# Altium schematic sheet LOGICA.SchDoc (part 2 of 2)
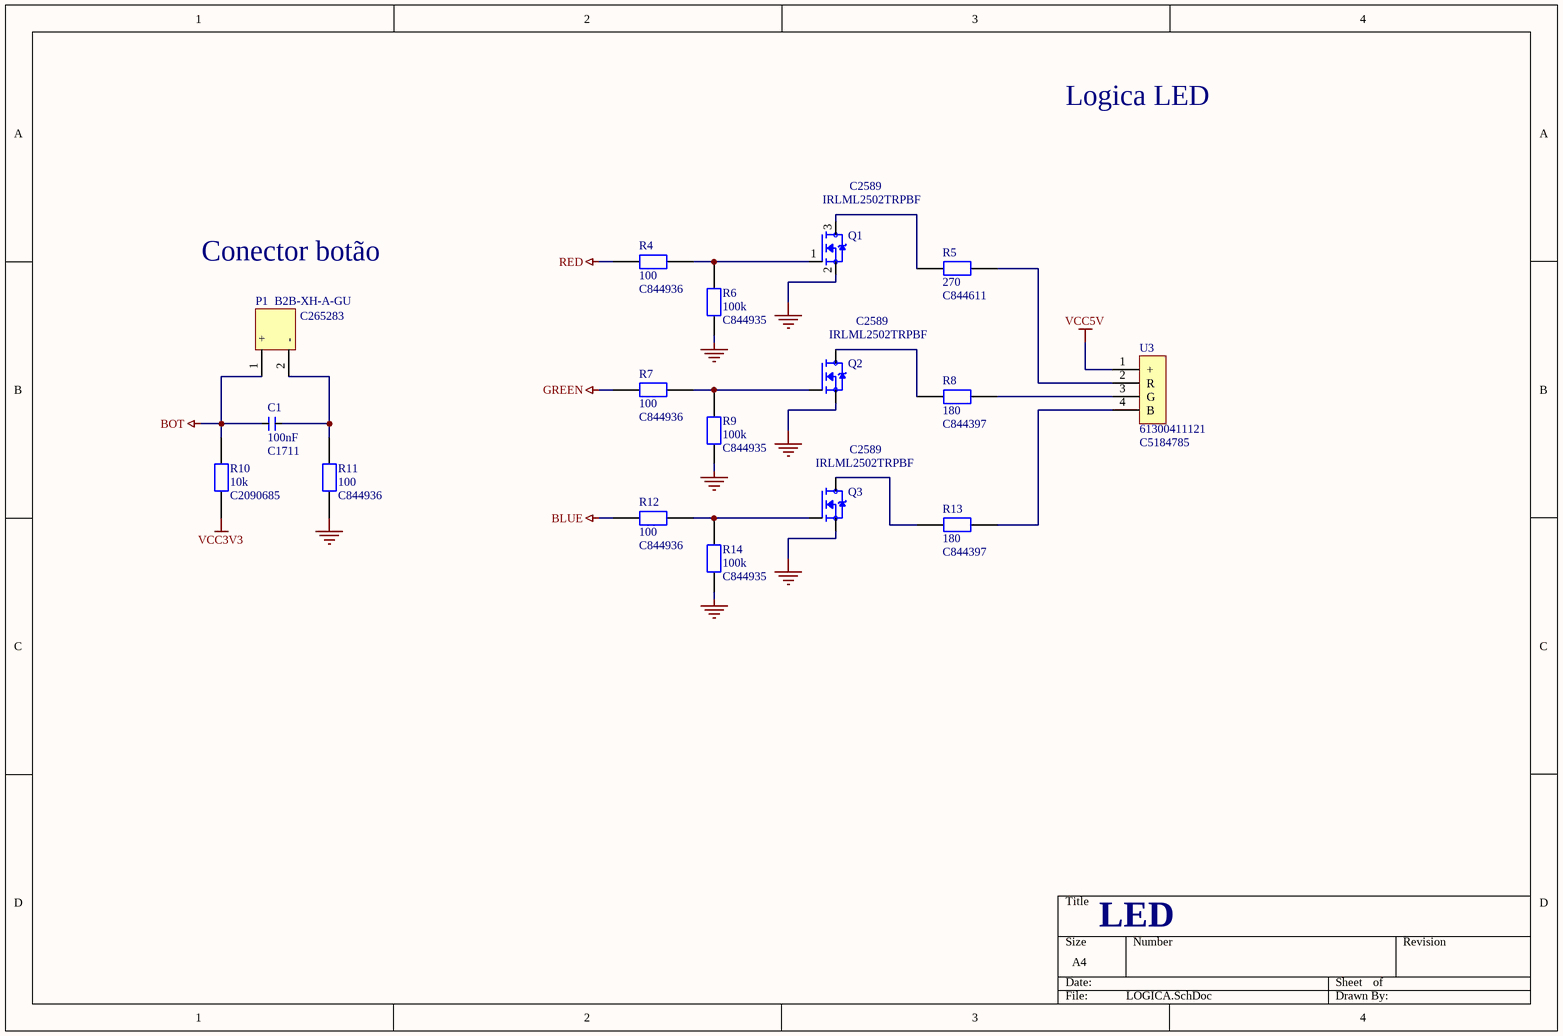
[diagram p1: LOGICA.SchDoc]

## Library data of the parts
C1 = CL21B104KBCNNNC: Ceramic Capacitor, Multilayer, Ceramic, 50V, 10% +Tol, 10% -Tol, X7R, +-15% TC, 100nF, Surface Mount, 0805 inch; Manufacturer: Samsung Electro-Mechanics; Supplier 1: Avnet; Supplier Part Number 1: CL21B104KBCNNNC; Manufacturer Part Number: CL21B104KBCNNNC; RoHS: Compliant; Category: Ceramic Capacitors; Stock 1: 2653700; Pricing 1: 4000=0,0047, 8000=0,00468, 16000=0,00466, 32000=0,00463, 64000=0,00461 (USD); Capacitance: 100nF; Case/Package: 0805; Case Code (Imperial): 0805; Case Code (Metric): 2012; China RoHS: Compliant; Contact Plating: Tin; Depth: 1.25mm; Dielectric: X7R; Dielectric Material: Ceramic; Height: 950µm; Lead Free: Lead Free; Length: 2mm; Lifecycle Status: Production; Material: Ceramic; Max Operating Temperature: 125°C; Min Operating Temperature: -55°C; Mount: Surface Mount; Number of Terminals: 2; Radiation Hardening: No; REACH SVHC: Yes; Schedule B: 8532240020, 8532240020|8532240020, 8532240020|8532240020|8532240020, 8532240020|8532240020|8532240020|8532240020; Thickness: 939.8µm; Tolerance: 10%; Voltage: 50V; Voltage Rating: 50V; Voltage Rating (DC): 50V; Width: 1.25mm; ComponentLink1URL: https://datasheet.octopart.com:443/CL21B104KBCNNNC-Samsung-Electro-Mechanics-datasheet-137745078.pdf?src-supplier=IHS; ComponentLink1Description: https://datasheet.octopart.com:443/CL21B104KBCNNNC-Samsung-Electro-Mechanics-datasheet-137745078.pdf?src-supplier=IHS; ComponentLink2URL: https://datasheet.octopart.com/CL21B104KBCNNNC-Samsung-Electro-Mechanics-datasheet-8324245.pdf; ComponentLink2Description: https://datasheet.octopart.com/CL21B104KBCNNNC-Samsung-Electro-Mechanics-datasheet-8324245.pdf; ComponentLink3URL: https://datasheet.octopart.com/CL21B104KBCNNNC-Samsung-Electro-Mechanics-datasheet-97040617.pdf; ComponentLink3Description: https://datasheet.octopart.com/CL21B104KBCNNNC-Samsung-Electro-Mechanics-datasheet-97040617.pdf; ComponentLink4URL: https://datasheet.octopart.com:443/CL21B104KBCNNNC-Samsung-Electro-Mechanics-datasheet-11548950.pdf?src-supplier=Future+Electronics; ComponentLink4Description: https://datasheet.octopart.com:443/CL21B104KBCNNNC-Samsung-Electro-Mechanics-datasheet-11548950.pdf?src-supplier=Future+Electronics; ComponentLink5URL: https://datasheet.octopart.com:443/CL21B104KBCNNNC-Samsung-Electro-Mechanics-datasheet-116891032.pdf?src-supplier=Future+Electronics; ComponentLink5Description: https://datasheet.octopart.com:443/CL21B104KBCNNNC-Samsung-Electro-Mechanics-datasheet-116891032.pdf?src-supplier=Future+Electronics; ComponentLink6URL: https://datasheet.octopart.com:443/CL21B104KBCNNNC-Samsung-Electro-Mechanics-datasheet-81462175.pdf?src-supplier=Future+Electronics; ComponentLink6Description: https://datasheet.octopart.com:443/CL21B104KBCNNNC-Samsung-Electro-Mechanics-datasheet-81462175.pdf?src-supplier=Future+Electronics; ComponentLink7URL: https://datasheet.octopart.com:443/CL21B104KBCNNNC-Samsung-datasheet-42485244.pdf?src-supplier=Future+Electronics; ComponentLink7Description: https://datasheet.octopart.com:443/CL21B104KBCNNNC-Samsung-datasheet-42485244.pdf?src-supplier=Future+Electronics; ComponentLink8URL: https://datasheet.octopart.com:443/CL21B104KBCNNNC-Samsung-Electro-Mechanics-datasheet-149045937.pdf?src-supplier=Future+Electronics; ComponentLink8Description: https://datasheet.octopart.com:443/CL21B104KBCNNNC-Samsung-Electro-Mechanics-datasheet-149045937.pdf?src-supplier=Future+Electronics; ComponentLink9URL: https://datasheet.octopart.com:443/CL21B104KBCNNNC-Samsung-datasheet-8326407.pdf?src-supplier=TME; ComponentLink9Description: https://datasheet.octopart.com:443/CL21B104KBCNNNC-Samsung-datasheet-8326407.pdf?src-supplier=TME
P1 = B2B-XH-A-GU: Conector 2 pinos; Manufacturer: JST; Connector Type: Male Pin; Number of Positions: 2; Pitch: 2.4892mm; Supplier: DigiKey; Supplier Part Number: 455-2946-ND; Manufacturer Part Number: B2B-XH-A-GU; Category: Headers and Wire Housings; Stock: 16934; Pricing: 1=0,25, 10=0,212, 100=0,1804, 500=0,16102, 1000=0,15333, 5000=0,13685, 10000=0,13032 (USD); Color: Natural; Contact Gender: Male; Contact Material: Brass; Contact Plating: Tin; Fastening Type: Detent; Lead Free: Lead Free; Lifecycle Status: Production; Mounting Technology: Through Hole; Pins: 2; Number of Rows: 1; RoHS: Non-Compliant; Terminal Pitch: 2.5mm; Termination: Press-Fit; ComponentLink1URL: https://datasheet.octopart.com:443/B2B-XH-A-GU-JST-datasheet-12510042.pdf?src-supplier=IHS; ComponentLink1Description: https://datasheet.octopart.com:443/B2B-XH-A-GU-JST-datasheet-12510042.pdf?src-supplier=IHS; ComponentLink2URL: https://datasheet.octopart.com:443/B2B-XH-A-GU-JST-datasheet-140264791.pdf?src-supplier=LKR; ComponentLink2Description: https://datasheet.octopart.com:443/B2B-XH-A-GU-JST-datasheet-140264791.pdf?src-supplier=LKR; ComponentLink3URL: https://datasheet.octopart.com:443/B2B-XH-A-GU-JST-datasheet-8325564.pdf?src-supplier=Future+Electronics; ComponentLink3Description: https://datasheet.octopart.com:443/B2B-XH-A-GU-JST-datasheet-8325564.pdf?src-supplier=Future+Electronics
Q1-Q3 = IRLML2502TRPBF: Transistor: N-MOSFET; unipolar; 12V; 4.3A; 0.05ohm; 1.3W; -55+150 deg.C; SMD; SOT23; Manufacturer: Infineon; Manufacturer Package Identifier: Micro3™; Continuous Drain Current (ID): 4.2A; Drain to Source Breakdown Voltage: 20V; Drain to Source Resistance: 45mΩ; Element Configuration: Single; Fall Time: 26ns; Input Capacitance: 740pF; Max Junction Temperature (Tj): 150°C; Max Power Dissipation: 1.25W; Nominal Vgs: 1.2V; Number of Elements: 1; Value: 45mΩ; Rise Time: 10ns; Turn-Off Delay Time: 54ns; Turn-On Delay Time: 7.5ns; Supplier: DigiKey; Supplier Part Number: IRLML2502TRPBFCT-ND; Manufacturer Part Number: IRLML2502TRPBF; RoHS: Compliant; Category: MOSFETs; Stock: 39178; Pricing: 1=0,52, 10=0,323, 100=0,2053, 500=0,15428, 1000=0,13782 (USD); Case/Package: SOT-23; Contact Plating: Tin; Current Rating: 4.2A; Drain to Source Voltage (Vdss): 20V; Dual Supply Voltage: 20V; Gate to Source Voltage (Vgs): 12V; Height: 1.016mm; Lead Free: Lead Free; Length: 2.794mm; Lifecycle Status: NRND; Max Operating Temperature: 150°C; Min Breakdown Voltage: 20V; Min Operating Temperature: -55°C; Mounting Technology: Surface Mount; Pins: 3; Number of Terminals: 3; On-State Resistance: 45mΩ; Package Quantity: 3000; Packaging: Tape & Reel; Power Dissipation: 1.25W; Radiation Hardening: No; Rds On Max: 45mΩ; REACH SVHC: Yes; Schedule B: 8541290080, 8541290080|8541290080|8541290080|8541290080|8541290080; Termination: SMD/SMT; Threshold Voltage: 1.2V; Voltage Rating (DC): 20V; ComponentLink1URL: https://datasheet.octopart.com:443/IRLML2502TRPBF-Infineon-datasheet-34171437.pdf?src-supplier=IHS; ComponentLink1Description: https://datasheet.octopart.com:443/IRLML2502TRPBF-Infineon-datasheet-34171437.pdf?src-supplier=IHS; ComponentLink2URL: https://datasheet.octopart.com:443/IRLML2502-International-Rectifier-datasheet-180124963.pdf?src-supplier=IHS; ComponentLink2Description: https://datasheet.octopart.com:443/IRLML2502-International-Rectifier-datasheet-180124963.pdf?src-supplier=IHS; ComponentLink3URL: https://datasheet.octopart.com:443/IRLML2502TRPBF-Infineon-datasheet-180073321.pdf?src-supplier=Newark; ComponentLink3Description: https://datasheet.octopart.com:443/IRLML2502TRPBF-Infineon-datasheet-180073321.pdf?src-supplier=Newark; ComponentLink4URL: https://datasheet.octopart.com:443/IRLML2502TRPBF-International-Rectifier-datasheet-28942.pdf?src-supplier=element14+APAC; ComponentLink4Description: https://datasheet.octopart.com:443/IRLML2502TRPBF-International-Rectifier-datasheet-28942.pdf?src-supplier=element14+APAC; ComponentLink5URL: https://datasheet.octopart.com:443/IRLML2502TRPBF-Infineon-datasheet-10898080.pdf?src-supplier=element14+APAC; ComponentLink5Description: https://datasheet.octopart.com:443/IRLML2502TRPBF-Infineon-datasheet-10898080.pdf?src-supplier=element14+APAC; ComponentLink6URL: https://datasheet.octopart.com:443/IRLML2502TRPBF-Infineon-datasheet-7576328.pdf?src-supplier=element14+APAC; ComponentLink6Description: https://datasheet.octopart.com:443/IRLML2502TRPBF-Infineon-datasheet-7576328.pdf?src-supplier=element14+APAC; ComponentLink7URL: https://datasheet.octopart.com:443/IRLML2502TRPBF-International-Rectifier-datasheet-14058069.pdf?src-supplier=iiiC; ComponentLink7Description: https://datasheet.octopart.com:443/IRLML2502TRPBF-International-Rectifier-datasheet-14058069.pdf?src-supplier=iiiC; ComponentLink8URL: https://datasheet.octopart.com:443/IRLML2502-International-Rectifier-datasheet-10851050.pdf?src-supplier=iiiC; ComponentLink8Description: https://datasheet.octopart.com:443/IRLML2502-International-Rectifier-datasheet-10851050.pdf?src-supplier=iiiC; ComponentLink9URL: https://datasheet.octopart.com:443/IRLML2502TRPBF-Infineon-datasheet-9906866.pdf?src-supplier=RS+(Formerly+Allied+Electronics); ComponentLink9Description: https://datasheet.octopart.com:443/IRLML2502TRPBF-Infineon-datasheet-9906866.pdf?src-supplier=RS+(Formerly+Allied+Electronics); ComponentLink10URL: https://datasheet.octopart.com:443/IRLML2502TRPBF-International-Rectifier-datasheet-10470232.pdf?src-supplier=TME; ComponentLink10Description: https://datasheet.octopart.com:443/IRLML2502TRPBF-International-Rectifier-datasheet-10470232.pdf?src-supplier=TME; ComponentLink11URL: https://datasheet.octopart.com:443/IRLML2502TRPBF-International-Rectifier-datasheet-8360198.pdf?src-supplier=Jameco; ComponentLink11Description: https://datasheet.octopart.com:443/IRLML2502TRPBF-International-Rectifier-datasheet-8360198.pdf?src-supplier=Jameco; ComponentLink12URL: https://datasheet.octopart.com:443/IRLML2502TRPBF-International-Rectifier-datasheet-63679.pdf?src-supplier=Farnell; ComponentLink12Description: https://datasheet.octopart.com:443/IRLML2502TRPBF-International-Rectifier-datasheet-63679.pdf?src-supplier=Farnell; ComponentLink13URL: https://datasheet.octopart.com:443/IRLML2502TRPBF-International-Rectifier-datasheet-89315.pdf?src-supplier=DigiKey; ComponentLink13Description: https://datasheet.octopart.com:443/IRLML2502TRPBF-International-Rectifier-datasheet-89315.pdf?src-supplier=DigiKey; ComponentLink14URL: http://sigma.octopart.com:80/conflict_mineral_statement/Infineon-company-51.pdf?src-supplier=Compliance+Statements; ComponentLink14Description: http://sigma.octopart.com:80/conflict_mineral_statement/Infineon-company-51.pdf?src-supplier=Compliance+Statements; ComponentLink15URL: http://sigma.octopart.com:80/rohs_statement/International-Rectifier-company-54.pdf?src-supplier=Compliance+Statements; ComponentLink15Description: http://sigma.octopart.com:80/rohs_statement/International-Rectifier-company-54.pdf?src-supplier=Compliance+Statements; ComponentLink16URL: http://sigma.octopart.com:80/reach_statement/International-Rectifier-company-55.pdf?src-supplier=Compliance+Statements; ComponentLink16Description: http://sigma.octopart.com:80/reach_statement/International-Rectifier-company-55.pdf?src-supplier=Compliance+Statements
R4 R7 R11 R12 = CRCW0805100RFKEA: Res Thick Film 0805 100 Ohm 1% 0.125W(1/8W) ±100ppm/℃ Pad SMD Automotive T/R; Manufacturer: Vishay; Manufacturer Package Identifier: CRCW0805-e3; Max Power Dissipation: 125mW; Value: 100Ω; Temperature Coefficient: 100ppm/°C; Voltage Rating: 150V; Supplier: DigiKey; Supplier Part Number: 541-100CCT-ND; Manufacturer Part Number: CRCW0805100RFKEA; RoHS: Compliant; Category: Chip SMD Resistors; Stock: 224684; Pricing: 1=0,1, 10=0,041, 25=0,0312, 50=0,0256, 100=0,0212, 250=0,01692, 500=0,01448, 1000=0,01254 (USD); Case/Package: 0805; Case Code (Imperial): 0805; China RoHS: Non-Compliant; Composition: Thick Film; Contact Plating: Tin; Depth: 1.25mm; Features: Automotive AEC-Q200; Height: 450µm; Lead Free: Lead Free; Length: 2mm; Lifecycle Status: Production; Max Operating Temperature: 155°C; Military Standard: Not; Min Operating Temperature: -55°C; Mounting Technology: Surface Mount; Pins: 2; Number of Terminals: 2; Number of Terminations: 2; Power Dissipation: 125mW; Power Rating: 125mW; Radiation Hardening: No; REACH SVHC: Yes; Schedule B: 8533210045, 8533210045|8533210045|8533210045|8533210045|8533210045|8533210045|8533210045|8533210045|8533210045|8533210045|8533210045|8533210045|8533210045|8533210045|8533210045|8533210045|8533210045|8533210045|8533210045|8533210045|8533210045|8533210045|8533210045|85; Termination: SMD/SMT; Tolerance: 1%; Voltage Rating (DC): 150V; Weight: 5.499807mg; Width: 1.25mm; Working Voltage: 150V; ComponentLink1URL: https://datasheet.octopart.com:443/CRCW0805100RFKEA-Vishay-datasheet-175423584.pdf?src-supplier=IHS; ComponentLink1Description: https://datasheet.octopart.com:443/CRCW0805100RFKEA-Vishay-datasheet-175423584.pdf?src-supplier=IHS; ComponentLink2URL: https://datasheet.octopart.com:443/CRCW0805100RFKEA-Vishay-datasheet-83961561.pdf?src-supplier=Newark; ComponentLink2Description: https://datasheet.octopart.com:443/CRCW0805100RFKEA-Vishay-datasheet-83961561.pdf?src-supplier=Newark; ComponentLink3URL: https://datasheet.octopart.com:443/CRCW0805100RFKEA-Vishay-datasheet-11516975.pdf?src-supplier=Newark; ComponentLink3Description: https://datasheet.octopart.com:443/CRCW0805100RFKEA-Vishay-datasheet-11516975.pdf?src-supplier=Newark; ComponentLink4URL: https://datasheet.octopart.com:443/CRCW0805100RFKEA-Vishay-datasheet-41302739.pdf?src-supplier=Newark; ComponentLink4Description: https://datasheet.octopart.com:443/CRCW0805100RFKEA-Vishay-datasheet-41302739.pdf?src-supplier=Newark; ComponentLink5URL: https://datasheet.octopart.com:443/CRCW0805100RFKEA-Vishay-datasheet-33013972.pdf?src-supplier=Newark; ComponentLink5Description: https://datasheet.octopart.com:443/CRCW0805100RFKEA-Vishay-datasheet-33013972.pdf?src-supplier=Newark; ComponentLink6URL: https://datasheet.octopart.com:443/CRCW0805100RFKEA-Vishay-datasheet-62317937.pdf?src-supplier=element14+APAC; ComponentLink6Description: https://datasheet.octopart.com:443/CRCW0805100RFKEA-Vishay-datasheet-62317937.pdf?src-supplier=element14+APAC; ComponentLink7URL: https://datasheet.octopart.com:443/CRCW0805100RFKEA-Vishay-datasheet-14722531.pdf?src-supplier=element14+APAC; ComponentLink7Description: https://datasheet.octopart.com:443/CRCW0805100RFKEA-Vishay-datasheet-14722531.pdf?src-supplier=element14+APAC; ComponentLink8URL: https://datasheet.octopart.com:443/CRCW0805100RFKEA.-Vishay-datasheet-78776209.pdf?src-supplier=element14+APAC; ComponentLink8Description: https://datasheet.octopart.com:443/CRCW0805100RFKEA.-Vishay-datasheet-78776209.pdf?src-supplier=element14+APAC; ComponentLink9URL: https://datasheet.octopart.com:443/CRCW0805100RFKEA-Vishay-datasheet-66077789.pdf?src-supplier=element14+APAC; ComponentLink9Description: https://datasheet.octopart.com:443/CRCW0805100RFKEA-Vishay-datasheet-66077789.pdf?src-supplier=element14+APAC; ComponentLink10URL: https://datasheet.octopart.com:443/CRCW0805100RFKEA-Vishay-datasheet-16179825.pdf?src-supplier=element14+APAC; ComponentLink10Description: https://datasheet.octopart.com:443/CRCW0805100RFKEA-Vishay-datasheet-16179825.pdf?src-supplier=element14+APAC; ComponentLink11URL: https://datasheet.octopart.com:443/CRCW0805100RFKEA-Vishay-datasheet-5300368.pdf?src-supplier=Future+Electronics; ComponentLink11Description: https://datasheet.octopart.com:443/CRCW0805100RFKEA-Vishay-datasheet-5300368.pdf?src-supplier=Future+Electronics; ComponentLink12URL: https://datasheet.octopart.com:443/CRCW0805100RFKEA-Vishay-datasheet-62316122.pdf?src-supplier=Future+Electronics; ComponentLink12Description: https://datasheet.octopart.com:443/CRCW0805100RFKEA-Vishay-datasheet-62316122.pdf?src-supplier=Future+Electronics; ComponentLink13URL: https://datasheet.octopart.com:443/CRCW0805100RFKEA-Vishay-datasheet-5306405.pdf?src-supplier=RS+(Formerly+Allied+Electronics); ComponentLink13Description: https://datasheet.octopart.com:443/CRCW0805100RFKEA-Vishay-datasheet-5306405.pdf?src-supplier=RS+(Formerly+Allied+Electronics); ComponentLink14URL: https://datasheet.octopart.com:443/CRCW0805100RFKEA-Vishay-Dale-datasheet-47688880.pdf?src-supplier=RS+(Formerly+Allied+Electronics); ComponentLink14Description: https://datasheet.octopart.com:443/CRCW0805100RFKEA-Vishay-Dale-datasheet-47688880.pdf?src-supplier=RS+(Formerly+Allied+Electronics); ComponentLink15URL: https://datasheet.octopart.com:443/CRCW0805100RFKEA-Vishay-datasheet-12001583.pdf?src-supplier=RS+(Formerly+Allied+Electronics); ComponentLink15Description: https://datasheet.octopart.com:443/CRCW0805100RFKEA-Vishay-datasheet-12001583.pdf?src-supplier=RS+(Formerly+Allied+Electronics); ComponentLink16URL: https://datasheet.octopart.com:443/CRCW0805100RFKEA-Vishay-datasheet-17834126.pdf?src-supplier=TME; ComponentLink16Description: https://datasheet.octopart.com:443/CRCW0805100RFKEA-Vishay-datasheet-17834126.pdf?src-supplier=TME; ComponentLink17URL: https://datasheet.octopart.com/D-CRCW-e3-Standard-Thick-Film-Chip-Resistors-Vishay-datasheet-family-64.pdf; ComponentLink17Description: https://datasheet.octopart.com/D-CRCW-e3-Standard-Thick-Film-Chip-Resistors-Vishay-datasheet-family-64.pdf; ComponentLink18URL: https://datasheet.octopart.com:443/CRCW0805100RFKEA-Vishay-datasheet-13242068.pdf?src-supplier=Farnell; ComponentLink18Description: https://datasheet.octopart.com:443/CRCW0805100RFKEA-Vishay-datasheet-13242068.pdf?src-supplier=Farnell; ComponentLink19URL: https://datasheet.octopart.com:443/CRCW0805100RFKEA-Vishay-datasheet-13195083.pdf?src-supplier=Farnell; ComponentLink19Description: https://datasheet.octopart.com:443/CRCW0805100RFKEA-Vishay-datasheet-13195083.pdf?src-supplier=Farnell; ComponentLink20URL: https://datasheet.octopart.com:443/CRCW0805100RFKEA-Vishay-datasheet-13034211.pdf?src-supplier=Farnell; ComponentLink20Description: https://datasheet.octopart.com:443/CRCW0805100RFKEA-Vishay-datasheet-13034211.pdf?src-supplier=Farnell; ComponentLink21URL: https://datasheet.octopart.com:443/CRCW0805100RFKEA-Vishay-datasheet-12600034.pdf?src-supplier=Farnell; ComponentLink21Description: https://datasheet.octopart.com:443/CRCW0805100RFKEA-Vishay-datasheet-12600034.pdf?src-supplier=Farnell; ComponentLink22URL: https://datasheet.octopart.com:443/CRCW0805100RFKEA-Vishay-datasheet-12532161.pdf?src-supplier=Farnell; ComponentLink22Description: https://datasheet.octopart.com:443/CRCW0805100RFKEA-Vishay-datasheet-12532161.pdf?src-supplier=Farnell; ComponentLink23URL: https://datasheet.octopart.com:443/CRCW0805100RFKEA-Vishay-datasheet-12517896.pdf?src-supplier=Farnell; ComponentLink23Description: https://datasheet.octopart.com:443/CRCW0805100RFKEA-Vishay-datasheet-12517896.pdf?src-supplier=Farnell; ComponentLink24URL: https://datasheet.octopart.com:443/CRCW0805100RFKEA-Vishay-datasheet-12509762.pdf?src-supplier=Farnell; ComponentLink24Description: https://datasheet.octopart.com:443/CRCW0805100RFKEA-Vishay-datasheet-12509762.pdf?src-supplier=Farnell; ComponentLink25URL: https://datasheet.octopart.com:443/CRCW0805100RFKEA-Vishay-datasheet-10322335.pdf?src-supplier=Farnell; ComponentLink25Description: https://datasheet.octopart.com:443/CRCW0805100RFKEA-Vishay-datasheet-10322335.pdf?src-supplier=Farnell; ComponentLink26URL: https://datasheet.octopart.com:443/CRCW0805100RFKEA-Vishay-datasheet-8788789.pdf?src-supplier=Farnell; ComponentLink26Description: https://datasheet.octopart.com:443/CRCW0805100RFKEA-Vishay-datasheet-8788789.pdf?src-supplier=Farnell; ComponentLink27URL: https://datasheet.octopart.com:443/CRCW0805100RFKEA-Vishay-datasheet-8361388.pdf?src-supplier=Farnell; ComponentLink27Description: https://datasheet.octopart.com:443/CRCW0805100RFKEA-Vishay-datasheet-8361388.pdf?src-supplier=Farnell; ComponentLink28URL: https://datasheet.octopart.com:443/CRCW0805100RFKEA-Vishay-datasheet-546287.pdf?src-supplier=Farnell; ComponentLink28Description: https://datasheet.octopart.com:443/CRCW0805100RFKEA-Vishay-datasheet-546287.pdf?src-supplier=Farnell; ComponentLink29URL: https://datasheet.octopart.com:443/CRCW0805100RFKEA-Vishay-datasheet-11540273.pdf?src-supplier=Arrow+Electronics; ComponentLink29Description: https://datasheet.octopart.com:443/CRCW0805100RFKEA-Vishay-datasheet-11540273.pdf?src-supplier=Arrow+Electronics; ComponentLink30URL: https://datasheet.octopart.com:443/CRCW0805100RFKEA-Vishay-datasheet-8445837.pdf?src-supplier=element14; ComponentLink30Description: https://datasheet.octopart.com:443/CRCW0805100RFKEA-Vishay-datasheet-8445837.pdf?src-supplier=element14; ComponentLink31URL: https://datasheet.octopart.com:443/CRCW0805100RFKEA-Vishay-datasheet-5377306.pdf?src-supplier=Garrett; ComponentLink31Description: https://datasheet.octopart.com:443/CRCW0805100RFKEA-Vishay-datasheet-5377306.pdf?src-supplier=Garrett; ComponentLink32URL: https://datasheet.octopart.com:443/CRCW0805100RFKEA-Vishay-datasheet-148188.pdf?src-supplier=Garrett; ComponentLink32Description: https://datasheet.octopart.com:443/CRCW0805100RFKEA-Vishay-datasheet-148188.pdf?src-supplier=Garrett; ComponentLink33URL: https://datasheet.octopart.com:443/CRCW0805100RFKEA-Vishay-datasheet-34203.pdf?src-supplier=Garrett; ComponentLink33Description: https://datasheet.octopart.com:443/CRCW0805100RFKEA-Vishay-datasheet-34203.pdf?src-supplier=Garrett; ComponentLink34URL: http://sigma.octopart.com:80/rohs_certificate/D-CRCW-e3-Standard-Thick-Film-Chip-Resistors-Vishay-family-102.pdf?src-supplier=Compliance+Statements; ComponentLink34Description: http://sigma.octopart.com:80/rohs_certificate/D-CRCW-e3-Standard-Thick-Film-Chip-Resistors-Vishay-family-102.pdf?src-supplier=Compliance+Statements
R5 = CRCW0805270RFKEA: Res Thick Film 0805 270 Ohm 1% 1/8W ±100ppm/°C Molded SMD SMD Paper T/R; Manufacturer: Vishay; Manufacturer Package Identifier: CRCW0805-e3; Power Dissipation: 125mW; Value: 270Ω; Voltage Rating: 150V; Supplier: DigiKey; Supplier Part Number: 541-270CCT-ND; Manufacturer Part Number: CRCW0805270RFKEA; RoHS: Compliant; Category: Chip SMD Resistors; Stock: 11086; Pricing: 1=0,1, 10=0,041, 25=0,0312, 50=0,0256, 100=0,0212, 250=0,01692, 500=0,01448, 1000=0,01254 (USD); Case/Package: 0805; Case Code (Imperial): 0805; China RoHS: Non-Compliant; Composition: Thick Film; Contact Plating: Tin; Depth: 1.25mm; Height: 450µm; Lead Free: Lead Free; Length: 2mm; Lifecycle Status: Production; Max Operating Temperature: 155°C; Military Standard: Not; Min Operating Temperature: -55°C; Mounting Technology: Surface Mount; Pins: 2; Number of Terminals: 2; Packaging: Cut Tape; Power Rating: 125mW; Radiation Hardening: No; REACH SVHC: Yes; Schedule B: 8533210045, 8533210045|8533210045, 8533210045|8533210045|8533210045, 8533210045|8533210045|8533210045|8533210045; Temperature Coefficient: 100ppm/°C; Termination: SMD/SMT; Tolerance: 1%; Voltage Rating (DC): 150V; Weight: 5.499807mg; Width: 1.25mm; Working Voltage: 150V; ComponentLink1URL: https://datasheet.octopart.com:443/CRCW0805270RFKEA-Vishay-datasheet-175423584.pdf?src-supplier=IHS; ComponentLink1Description: https://datasheet.octopart.com:443/CRCW0805270RFKEA-Vishay-datasheet-175423584.pdf?src-supplier=IHS; ComponentLink2URL: https://datasheet.octopart.com:443/CRCW0805270RFKEA-Vishay-datasheet-83961561.pdf?src-supplier=Newark; ComponentLink2Description: https://datasheet.octopart.com:443/CRCW0805270RFKEA-Vishay-datasheet-83961561.pdf?src-supplier=Newark; ComponentLink3URL: https://datasheet.octopart.com:443/CRCW0805270RFKEA-Vishay-datasheet-11516975.pdf?src-supplier=Newark; ComponentLink3Description: https://datasheet.octopart.com:443/CRCW0805270RFKEA-Vishay-datasheet-11516975.pdf?src-supplier=Newark; ComponentLink4URL: https://datasheet.octopart.com:443/CRCW0805270RFKEA-Vishay-datasheet-41302739.pdf?src-supplier=Newark; ComponentLink4Description: https://datasheet.octopart.com:443/CRCW0805270RFKEA-Vishay-datasheet-41302739.pdf?src-supplier=Newark; ComponentLink5URL: https://datasheet.octopart.com:443/CRCW0805270RFKEA-Vishay-datasheet-33013972.pdf?src-supplier=Newark; ComponentLink5Description: https://datasheet.octopart.com:443/CRCW0805270RFKEA-Vishay-datasheet-33013972.pdf?src-supplier=Newark; ComponentLink6URL: https://datasheet.octopart.com:443/CRCW0805270RFKEA-Vishay-datasheet-62317937.pdf?src-supplier=element14+APAC; ComponentLink6Description: https://datasheet.octopart.com:443/CRCW0805270RFKEA-Vishay-datasheet-62317937.pdf?src-supplier=element14+APAC; ComponentLink7URL: https://datasheet.octopart.com:443/CRCW0805270RFKEA-Vishay-datasheet-10882403.pdf?src-supplier=element14+APAC; ComponentLink7Description: https://datasheet.octopart.com:443/CRCW0805270RFKEA-Vishay-datasheet-10882403.pdf?src-supplier=element14+APAC; ComponentLink8URL: https://datasheet.octopart.com:443/CRCW0805270RFKEA.-Vishay-datasheet-78776209.pdf?src-supplier=element14+APAC; ComponentLink8Description: https://datasheet.octopart.com:443/CRCW0805270RFKEA.-Vishay-datasheet-78776209.pdf?src-supplier=element14+APAC; ComponentLink9URL: https://datasheet.octopart.com:443/CRCW0805270RFKEA-Vishay-datasheet-66077789.pdf?src-supplier=element14+APAC; ComponentLink9Description: https://datasheet.octopart.com:443/CRCW0805270RFKEA-Vishay-datasheet-66077789.pdf?src-supplier=element14+APAC; ComponentLink10URL: https://datasheet.octopart.com:443/CRCW0805270RFKEA-Vishay-datasheet-14722531.pdf?src-supplier=element14+APAC; ComponentLink10Description: https://datasheet.octopart.com:443/CRCW0805270RFKEA-Vishay-datasheet-14722531.pdf?src-supplier=element14+APAC; ComponentLink11URL: https://datasheet.octopart.com:443/CRCW0805270RFKEA-Vishay-datasheet-62316122.pdf?src-supplier=Future+Electronics; ComponentLink11Description: https://datasheet.octopart.com:443/CRCW0805270RFKEA-Vishay-datasheet-62316122.pdf?src-supplier=Future+Electronics; ComponentLink12URL: https://datasheet.octopart.com:443/CRCW0805270RFKEA-Vishay-datasheet-12519820.pdf?src-supplier=Future+Electronics; ComponentLink12Description: https://datasheet.octopart.com:443/CRCW0805270RFKEA-Vishay-datasheet-12519820.pdf?src-supplier=Future+Electronics; ComponentLink13URL: https://datasheet.octopart.com:443/CRCW0805270RFKEA-Vishay-datasheet-11551479.pdf?src-supplier=Future+Electronics; ComponentLink13Description: https://datasheet.octopart.com:443/CRCW0805270RFKEA-Vishay-datasheet-11551479.pdf?src-supplier=Future+Electronics; ComponentLink14URL: https://datasheet.octopart.com:443/CRCW0805270RFKEA-Vishay-datasheet-8325159.pdf?src-supplier=Future+Electronics; ComponentLink14Description: https://datasheet.octopart.com:443/CRCW0805270RFKEA-Vishay-datasheet-8325159.pdf?src-supplier=Future+Electronics; ComponentLink15URL: https://datasheet.octopart.com:443/CRCW0805270RFKEA-Vishay-datasheet-5390187.pdf?src-supplier=Future+Electronics; ComponentLink15Description: https://datasheet.octopart.com:443/CRCW0805270RFKEA-Vishay-datasheet-5390187.pdf?src-supplier=Future+Electronics; ComponentLink16URL: https://datasheet.octopart.com:443/CRCW0805270RFKEA-Vishay-Dale-datasheet-47688880.pdf?src-supplier=RS+(Formerly+Allied+Electronics); ComponentLink16Description: https://datasheet.octopart.com:443/CRCW0805270RFKEA-Vishay-Dale-datasheet-47688880.pdf?src-supplier=RS+(Formerly+Allied+Electronics); ComponentLink17URL: https://datasheet.octopart.com:443/CRCW0805270RFKEA-Vishay-datasheet-12001583.pdf?src-supplier=RS+(Formerly+Allied+Electronics); ComponentLink17Description: https://datasheet.octopart.com:443/CRCW0805270RFKEA-Vishay-datasheet-12001583.pdf?src-supplier=RS+(Formerly+Allied+Electronics); ComponentLink18URL: https://datasheet.octopart.com:443/CRCW0805270RFKEA-Vishay-datasheet-5306405.pdf?src-supplier=RS+(Formerly+Allied+Electronics); ComponentLink18Description: https://datasheet.octopart.com:443/CRCW0805270RFKEA-Vishay-datasheet-5306405.pdf?src-supplier=RS+(Formerly+Allied+Electronics); ComponentLink19URL: https://datasheet.octopart.com:443/CRCW0805270RFKEA-Vishay-datasheet-8445837.pdf?src-supplier=element14; ComponentLink19Description: https://datasheet.octopart.com:443/CRCW0805270RFKEA-Vishay-datasheet-8445837.pdf?src-supplier=element14; ComponentLink20URL: https://datasheet.octopart.com:443/CRCW0805270RFKEA-Vishay-datasheet-5300368.pdf?src-supplier=Farnell; ComponentLink20Description: https://datasheet.octopart.com:443/CRCW0805270RFKEA-Vishay-datasheet-5300368.pdf?src-supplier=Farnell; ComponentLink21URL: http://sigma.octopart.com:80/rohs_statement/Vishay-company-15.pdf?src-supplier=Compliance+Statements; ComponentLink21Description: http://sigma.octopart.com:80/rohs_statement/Vishay-company-15.pdf?src-supplier=Compliance+Statements
R6 R9 R14 = CRCW0805100KFKEA: Res Thick Film 0805 100K Ohm 1% 0.125W(1/8W) +/-100ppm/ßC Pad SMD Automotive T/R; Manufacturer: Vishay; Manufacturer Package Identifier: CRCW0805-e3; Power Dissipation: 125mW; Value: 100kΩ; Temperature Coefficient: 100ppm/°C; Voltage Rating: 150V; Supplier: DigiKey; Supplier Part Number: 541-100KCCT-ND; Manufacturer Part Number: CRCW0805100KFKEA; RoHS: Compliant; Category: Chip SMD Resistors; Stock: 307439; Pricing: 1=0,1, 10=0,041, 25=0,0312, 50=0,0256, 100=0,0212, 250=0,01692, 500=0,01448, 1000=0,01254 (USD); Case/Package: 0805; Case Code (Imperial): 0805; China RoHS: Non-Compliant; Composition: Thick Film; Contact Plating: Tin; Depth: 1.25mm; Height: 450µm; Lead Free: Lead Free; Length: 2mm; Lifecycle Status: Production; Max Operating Temperature: 155°C; Military Standard: Not; Min Operating Temperature: -55°C; Mounting Technology: Surface Mount; Pins: 2; Number of Terminals: 2; Packaging: Cut Tape; Power Rating: 125mW; Radiation Hardening: No; REACH SVHC: Yes; Schedule B: 8533210045, 8533210045|8533210045|8533210045|8533210045|8533210045|8533210045|8533210045|8533210045|8533210045|8533210045|8533210045|8533210045|8533210045|8533210045|8533210045|8533210045|8533210045|8533210045|8533210045|8533210045|8533210045|8533210045|8533210045|85; Termination: SMD/SMT; Tolerance: 1%; Voltage Rating (DC): 150V; Weight: 5.499807mg; Width: 1.25mm; Working Voltage: 150V; ComponentLink1URL: https://datasheet.octopart.com:443/CRCW0805100KFKEA-Vishay-datasheet-175423584.pdf?src-supplier=IHS; ComponentLink1Description: https://datasheet.octopart.com:443/CRCW0805100KFKEA-Vishay-datasheet-175423584.pdf?src-supplier=IHS; ComponentLink2URL: https://datasheet.octopart.com:443/CRCW0805100KFKEA-Vishay-datasheet-141435152.pdf?src-supplier=Upverter; ComponentLink2Description: https://datasheet.octopart.com:443/CRCW0805100KFKEA-Vishay-datasheet-141435152.pdf?src-supplier=Upverter; ComponentLink3URL: https://datasheet.octopart.com:443/CRCW0805100KFKEA-Vishay-datasheet-83961561.pdf?src-supplier=element14+APAC; ComponentLink3Description: https://datasheet.octopart.com:443/CRCW0805100KFKEA-Vishay-datasheet-83961561.pdf?src-supplier=element14+APAC; ComponentLink4URL: https://datasheet.octopart.com:443/CRCW0805100KFKEA-Vishay-datasheet-62317937.pdf?src-supplier=element14+APAC; ComponentLink4Description: https://datasheet.octopart.com:443/CRCW0805100KFKEA-Vishay-datasheet-62317937.pdf?src-supplier=element14+APAC; ComponentLink5URL: https://datasheet.octopart.com:443/CRCW0805100KFKEA-Vishay-datasheet-14722531.pdf?src-supplier=element14+APAC; ComponentLink5Description: https://datasheet.octopart.com:443/CRCW0805100KFKEA-Vishay-datasheet-14722531.pdf?src-supplier=element14+APAC; ComponentLink6URL: https://datasheet.octopart.com:443/CRCW0805100KFKEA-Vishay-datasheet-66077789.pdf?src-supplier=element14+APAC; ComponentLink6Description: https://datasheet.octopart.com:443/CRCW0805100KFKEA-Vishay-datasheet-66077789.pdf?src-supplier=element14+APAC; ComponentLink7URL: https://datasheet.octopart.com:443/CRCW0805100KFKEA-Vishay-datasheet-16179825.pdf?src-supplier=element14+APAC; ComponentLink7Description: https://datasheet.octopart.com:443/CRCW0805100KFKEA-Vishay-datasheet-16179825.pdf?src-supplier=element14+APAC; ComponentLink8URL: https://datasheet.octopart.com:443/CRCW0805100KFKEA.-Vishay-datasheet-78776209.pdf?src-supplier=Newark; ComponentLink8Description: https://datasheet.octopart.com:443/CRCW0805100KFKEA.-Vishay-datasheet-78776209.pdf?src-supplier=Newark; ComponentLink9URL: https://datasheet.octopart.com:443/CRCW0805100KFKEA-Vishay-datasheet-11516975.pdf?src-supplier=Newark; ComponentLink9Description: https://datasheet.octopart.com:443/CRCW0805100KFKEA-Vishay-datasheet-11516975.pdf?src-supplier=Newark; ComponentLink10URL: https://datasheet.octopart.com:443/CRCW0805100KFKEA-Vishay-datasheet-33013972.pdf?src-supplier=Newark; ComponentLink10Description: https://datasheet.octopart.com:443/CRCW0805100KFKEA-Vishay-datasheet-33013972.pdf?src-supplier=Newark; ComponentLink11URL: https://datasheet.octopart.com:443/CRCW0805100KFKEA-Vishay-datasheet-21268114.pdf?src-supplier=Newark; ComponentLink11Description: https://datasheet.octopart.com:443/CRCW0805100KFKEA-Vishay-datasheet-21268114.pdf?src-supplier=Newark; ComponentLink12URL: https://datasheet.octopart.com:443/CRCW0805100KFKEA-Vishay-datasheet-5300368.pdf?src-supplier=Future+Electronics; ComponentLink12Description: https://datasheet.octopart.com:443/CRCW0805100KFKEA-Vishay-datasheet-5300368.pdf?src-supplier=Future+Electronics; ComponentLink13URL: https://datasheet.octopart.com:443/CRCW0805100KFKEA-Vishay-datasheet-62316122.pdf?src-supplier=Future+Electronics; ComponentLink13Description: https://datasheet.octopart.com:443/CRCW0805100KFKEA-Vishay-datasheet-62316122.pdf?src-supplier=Future+Electronics; ComponentLink14URL: https://datasheet.octopart.com:443/CRCW0805100KFKEA-Vishay-datasheet-5306405.pdf?src-supplier=RS+(Formerly+Allied+Electronics); ComponentLink14Description: https://datasheet.octopart.com:443/CRCW0805100KFKEA-Vishay-datasheet-5306405.pdf?src-supplier=RS+(Formerly+Allied+Electronics); ComponentLink15URL: https://datasheet.octopart.com:443/CRCW0805100KFKEA-Vishay-Dale-datasheet-47688880.pdf?src-supplier=RS+(Formerly+Allied+Electronics); ComponentLink15Description: https://datasheet.octopart.com:443/CRCW0805100KFKEA-Vishay-Dale-datasheet-47688880.pdf?src-supplier=RS+(Formerly+Allied+Electronics); ComponentLink16URL: https://datasheet.octopart.com:443/CRCW0805100KFKEA-Vishay-datasheet-12001583.pdf?src-supplier=RS+(Formerly+Allied+Electronics); ComponentLink16Description: https://datasheet.octopart.com:443/CRCW0805100KFKEA-Vishay-datasheet-12001583.pdf?src-supplier=RS+(Formerly+Allied+Electronics); ComponentLink17URL: https://datasheet.octopart.com:443/CRCW0805100KFKEA-Vishay-datasheet-17834126.pdf?src-supplier=TME; ComponentLink17Description: https://datasheet.octopart.com:443/CRCW0805100KFKEA-Vishay-datasheet-17834126.pdf?src-supplier=TME; ComponentLink18URL: https://datasheet.octopart.com:443/CRCW0805100KFKEA-Vishay-datasheet-13242068.pdf?src-supplier=Farnell; ComponentLink18Description: https://datasheet.octopart.com:443/CRCW0805100KFKEA-Vishay-datasheet-13242068.pdf?src-supplier=Farnell; ComponentLink19URL: https://datasheet.octopart.com:443/CRCW0805100KFKEA-Vishay-datasheet-13195083.pdf?src-supplier=Farnell; ComponentLink19Description: https://datasheet.octopart.com:443/CRCW0805100KFKEA-Vishay-datasheet-13195083.pdf?src-supplier=Farnell; ComponentLink20URL: https://datasheet.octopart.com:443/CRCW0805100KFKEA-Vishay-datasheet-13034211.pdf?src-supplier=Farnell; ComponentLink20Description: https://datasheet.octopart.com:443/CRCW0805100KFKEA-Vishay-datasheet-13034211.pdf?src-supplier=Farnell; ComponentLink21URL: https://datasheet.octopart.com:443/CRCW0805100KFKEA-Vishay-datasheet-12600034.pdf?src-supplier=Farnell; ComponentLink21Description: https://datasheet.octopart.com:443/CRCW0805100KFKEA-Vishay-datasheet-12600034.pdf?src-supplier=Farnell; ComponentLink22URL: https://datasheet.octopart.com:443/CRCW0805100KFKEA-Vishay-datasheet-12532161.pdf?src-supplier=Farnell; ComponentLink22Description: https://datasheet.octopart.com:443/CRCW0805100KFKEA-Vishay-datasheet-12532161.pdf?src-supplier=Farnell; ComponentLink23URL: https://datasheet.octopart.com:443/CRCW0805100KFKEA-Vishay-datasheet-12517896.pdf?src-supplier=Farnell; ComponentLink23Description: https://datasheet.octopart.com:443/CRCW0805100KFKEA-Vishay-datasheet-12517896.pdf?src-supplier=Farnell; ComponentLink24URL: https://datasheet.octopart.com:443/CRCW0805100KFKEA-Vishay-datasheet-12509762.pdf?src-supplier=Farnell; ComponentLink24Description: https://datasheet.octopart.com:443/CRCW0805100KFKEA-Vishay-datasheet-12509762.pdf?src-supplier=Farnell; ComponentLink25URL: https://datasheet.octopart.com:443/CRCW0805100KFKEA-Vishay-datasheet-10322335.pdf?src-supplier=Farnell; ComponentLink25Description: https://datasheet.octopart.com:443/CRCW0805100KFKEA-Vishay-datasheet-10322335.pdf?src-supplier=Farnell; ComponentLink26URL: https://datasheet.octopart.com:443/CRCW0805100KFKEA-Vishay-datasheet-8788789.pdf?src-supplier=Farnell; ComponentLink26Description: https://datasheet.octopart.com:443/CRCW0805100KFKEA-Vishay-datasheet-8788789.pdf?src-supplier=Farnell; ComponentLink27URL: https://datasheet.octopart.com:443/CRCW0805100KFKEA-Vishay-datasheet-8361388.pdf?src-supplier=Farnell; ComponentLink27Description: https://datasheet.octopart.com:443/CRCW0805100KFKEA-Vishay-datasheet-8361388.pdf?src-supplier=Farnell; ComponentLink28URL: https://datasheet.octopart.com:443/CRCW0805100KFKEA-Vishay-datasheet-546287.pdf?src-supplier=Farnell; ComponentLink28Description: https://datasheet.octopart.com:443/CRCW0805100KFKEA-Vishay-datasheet-546287.pdf?src-supplier=Farnell; ComponentLink29URL: https://datasheet.octopart.com:443/CRCW0805100KFKEA-Vishay-datasheet-11540273.pdf?src-supplier=Arrow+Electronics; ComponentLink29Description: https://datasheet.octopart.com:443/CRCW0805100KFKEA-Vishay-datasheet-11540273.pdf?src-supplier=Arrow+Electronics; ComponentLink30URL: https://datasheet.octopart.com:443/CRCW0805100KFKEA-Vishay-datasheet-8445837.pdf?src-supplier=element14; ComponentLink30Description: https://datasheet.octopart.com:443/CRCW0805100KFKEA-Vishay-datasheet-8445837.pdf?src-supplier=element14; ComponentLink31URL: https://datasheet.octopart.com:443/CRCW0805100KFKEA-Vishay-datasheet-5377306.pdf?src-supplier=Garrett; ComponentLink31Description: https://datasheet.octopart.com:443/CRCW0805100KFKEA-Vishay-datasheet-5377306.pdf?src-supplier=Garrett; ComponentLink32URL: https://datasheet.octopart.com:443/CRCW0805100KFKEA-Vishay-datasheet-148188.pdf?src-supplier=Garrett; ComponentLink32Description: https://datasheet.octopart.com:443/CRCW0805100KFKEA-Vishay-datasheet-148188.pdf?src-supplier=Garrett; ComponentLink33URL: https://datasheet.octopart.com:443/CRCW0805100KFKEA-Vishay-datasheet-34203.pdf?src-supplier=Garrett; ComponentLink33Description: https://datasheet.octopart.com:443/CRCW0805100KFKEA-Vishay-datasheet-34203.pdf?src-supplier=Garrett; ComponentLink34URL: http://sigma.octopart.com:80/rohs_statement/Vishay-company-15.pdf?src-supplier=Compliance+Statements; ComponentLink34Description: http://sigma.octopart.com:80/rohs_statement/Vishay-company-15.pdf?src-supplier=Compliance+Statements
R8 R13 = CRCW0805180RFKEA: Res Thick Film 0805 180 Ohm 1% 1/8W ±100ppm/°C Molded SMD SMD Paper T/R; Manufacturer: Vishay; Manufacturer Package Identifier: CRCW0805-e3; Max Power Dissipation: 125mW; Value: 180Ω; Voltage Rating: 150V; Supplier: DigiKey; Supplier Part Number: 541-180CCT-ND; Manufacturer Part Number: CRCW0805180RFKEA; RoHS: Compliant; Category: Chip SMD Resistors; Stock: 20841; Pricing: 1=0,1, 10=0,041, 25=0,0312, 50=0,0256, 100=0,0212, 250=0,01692, 500=0,01456, 1000=0,01254 (USD); Case/Package: 0805; Case Code (Imperial): 0805; China RoHS: Non-Compliant; Composition: Thick Film; Contact Plating: Tin; Depth: 1.25mm; Features: Automotive AEC-Q200; Height: 450µm; Lead Free: Lead Free; Length: 2mm; Lifecycle Status: Production; Max Operating Temperature: 155°C; Military Standard: Not; Min Operating Temperature: -55°C; Mounting Technology: Surface Mount; Pins: 2; Number of Terminals: 2; Number of Terminations: 2; Packaging: Cut Tape; Power Dissipation: 125mW; Power Rating: 125mW; Radiation Hardening: No; REACH SVHC: Yes; Schedule B: 8533210045, 8533210045|8533210045|8533210045|8533210045|8533210045|8533210045|8533210045|8533210045|8533210045|8533210045|8533210045|8533210045|8533210045|8533210045|8533210045|8533210045|8533210045|8533210045|8533210045|8533210045|8533210045|8533210045|8533210045|85; Temperature Coefficient: 100ppm/°C; Termination: SMD/SMT; Tolerance: 1%; Voltage Rating (DC): 150V; Weight: 5.499807mg; Width: 1.25mm; Working Voltage: 150V; ComponentLink1URL: https://datasheet.octopart.com:443/CRCW0805180RFKEA-Vishay-datasheet-175423584.pdf?src-supplier=IHS; ComponentLink1Description: https://datasheet.octopart.com:443/CRCW0805180RFKEA-Vishay-datasheet-175423584.pdf?src-supplier=IHS; ComponentLink2URL: https://datasheet.octopart.com:443/CRCW0805180RFKEA-Vishay-datasheet-5300368.pdf?src-supplier=Farnell; ComponentLink2Description: https://datasheet.octopart.com:443/CRCW0805180RFKEA-Vishay-datasheet-5300368.pdf?src-supplier=Farnell; ComponentLink3URL: https://datasheet.octopart.com:443/CRCW0805180RFKEA-Vishay-datasheet-83961561.pdf?src-supplier=Newark; ComponentLink3Description: https://datasheet.octopart.com:443/CRCW0805180RFKEA-Vishay-datasheet-83961561.pdf?src-supplier=Newark; ComponentLink4URL: https://datasheet.octopart.com:443/CRCW0805180RFKEA-Vishay-datasheet-11516975.pdf?src-supplier=Newark; ComponentLink4Description: https://datasheet.octopart.com:443/CRCW0805180RFKEA-Vishay-datasheet-11516975.pdf?src-supplier=Newark; ComponentLink5URL: https://datasheet.octopart.com:443/CRCW0805180RFKEA-Vishay-datasheet-41302739.pdf?src-supplier=Newark; ComponentLink5Description: https://datasheet.octopart.com:443/CRCW0805180RFKEA-Vishay-datasheet-41302739.pdf?src-supplier=Newark; ComponentLink6URL: https://datasheet.octopart.com:443/CRCW0805180RFKEA-Vishay-datasheet-33013972.pdf?src-supplier=Newark; ComponentLink6Description: https://datasheet.octopart.com:443/CRCW0805180RFKEA-Vishay-datasheet-33013972.pdf?src-supplier=Newark; ComponentLink7URL: https://datasheet.octopart.com:443/CRCW0805180RFKEA-Vishay-datasheet-66077789.pdf?src-supplier=element14+APAC; ComponentLink7Description: https://datasheet.octopart.com:443/CRCW0805180RFKEA-Vishay-datasheet-66077789.pdf?src-supplier=element14+APAC; ComponentLink8URL: https://datasheet.octopart.com:443/CRCW0805180RFKEA-Vishay-datasheet-62317937.pdf?src-supplier=element14+APAC; ComponentLink8Description: https://datasheet.octopart.com:443/CRCW0805180RFKEA-Vishay-datasheet-62317937.pdf?src-supplier=element14+APAC; ComponentLink9URL: https://datasheet.octopart.com:443/CRCW0805180RFKEA-Vishay-datasheet-10882403.pdf?src-supplier=element14+APAC; ComponentLink9Description: https://datasheet.octopart.com:443/CRCW0805180RFKEA-Vishay-datasheet-10882403.pdf?src-supplier=element14+APAC; ComponentLink10URL: https://datasheet.octopart.com:443/CRCW0805180RFKEA.-Vishay-datasheet-78776209.pdf?src-supplier=element14+APAC; ComponentLink10Description: https://datasheet.octopart.com:443/CRCW0805180RFKEA.-Vishay-datasheet-78776209.pdf?src-supplier=element14+APAC; ComponentLink11URL: https://datasheet.octopart.com:443/CRCW0805180RFKEA-Vishay-datasheet-14722531.pdf?src-supplier=element14+APAC; ComponentLink11Description: https://datasheet.octopart.com:443/CRCW0805180RFKEA-Vishay-datasheet-14722531.pdf?src-supplier=element14+APAC; ComponentLink12URL: https://datasheet.octopart.com:443/CRCW0805180RFKEA-Vishay-datasheet-62316122.pdf?src-supplier=Future+Electronics; ComponentLink12Description: https://datasheet.octopart.com:443/CRCW0805180RFKEA-Vishay-datasheet-62316122.pdf?src-supplier=Future+Electronics; ComponentLink13URL: https://datasheet.octopart.com:443/CRCW0805180RFKEA-Vishay-datasheet-12519820.pdf?src-supplier=Future+Electronics; ComponentLink13Description: https://datasheet.octopart.com:443/CRCW0805180RFKEA-Vishay-datasheet-12519820.pdf?src-supplier=Future+Electronics; ComponentLink14URL: https://datasheet.octopart.com:443/CRCW0805180RFKEA-Vishay-Dale-datasheet-47688880.pdf?src-supplier=RS+(Formerly+Allied+Electronics); ComponentLink14Description: https://datasheet.octopart.com:443/CRCW0805180RFKEA-Vishay-Dale-datasheet-47688880.pdf?src-supplier=RS+(Formerly+Allied+Electronics); ComponentLink15URL: https://datasheet.octopart.com:443/CRCW0805180RFKEA-Vishay-datasheet-12001583.pdf?src-supplier=RS+(Formerly+Allied+Electronics); ComponentLink15Description: https://datasheet.octopart.com:443/CRCW0805180RFKEA-Vishay-datasheet-12001583.pdf?src-supplier=RS+(Formerly+Allied+Electronics); ComponentLink16URL: https://datasheet.octopart.com:443/CRCW0805180RFKEA-Vishay-datasheet-5306405.pdf?src-supplier=RS+(Formerly+Allied+Electronics); ComponentLink16Description: https://datasheet.octopart.com:443/CRCW0805180RFKEA-Vishay-datasheet-5306405.pdf?src-supplier=RS+(Formerly+Allied+Electronics); ComponentLink17URL: https://datasheet.octopart.com:443/CRCW0805180RFKEA-Vishay-datasheet-8619608.pdf?src-supplier=element14; ComponentLink17Description: https://datasheet.octopart.com:443/CRCW0805180RFKEA-Vishay-datasheet-8619608.pdf?src-supplier=element14; ComponentLink18URL: https://datasheet.octopart.com:443/CRCW0805180RFKEA-Vishay-datasheet-5377306.pdf?src-supplier=Garrett; ComponentLink18Description: https://datasheet.octopart.com:443/CRCW0805180RFKEA-Vishay-datasheet-5377306.pdf?src-supplier=Garrett; ComponentLink19URL: http://sigma.octopart.com:80/rohs_statement/Vishay-company-15.pdf?src-supplier=Compliance+Statements; ComponentLink19Description: http://sigma.octopart.com:80/rohs_statement/Vishay-company-15.pdf?src-supplier=Compliance+Statements
R10 = MCU0805MD1002DP500: Fixed Resistor, Thin Film, 0.14W, 10000ohm, 150V, 0.5% +/-Tol, 25ppm/Cel, Surface Mount, 0805; Manufacturer: Vishay; Max Power Dissipation: 200mW; Power Dissipation: 140mW; Value: 10kΩ; Temperature Coefficient: 25ppm/°C; Supplier: DigiKey; Supplier Part Number: MCU0805-10.0K-MDCT-ND; Manufacturer Part Number: MCU0805MD1002DP500; RoHS: Compliant; Category: Chip SMD Resistors; Stock: 19723; Pricing: 1=0,13, 10=0,108, 25=0,1008, 50=0,095, 100=0,0897, 250=0,08332, 500=0,0789, 1000=0,07487 (USD); Case/Package: 0805; Case Code (Imperial): 0805; Case Code (Metric): 2012; China RoHS: Non-Compliant; Composition: Thin Film; Features: Automotive AEC-Q200; Height: 520µm; Length: 2.0066mm; Lifecycle Status: Production; Max Operating Temperature: 125°C; Min Operating Temperature: -55°C; Mounting Technology: Surface Mount; Number of Terminals: 2; Number of Terminations: 2; Packaging: Digi-Reel®; Power Rating: 200mW; REACH SVHC: Yes; Termination: SMD/SMT; Tolerance: 0.5%; Voltage Rating: 150V; Weight: 5.499807mg; Width: 1.25mm; Working Voltage: 150V; ComponentLink1URL: https://datasheet.octopart.com:443/MCU0805MD1002DP500-Vishay-datasheet-182027964.pdf?src-supplier=IHS; ComponentLink1Description: https://datasheet.octopart.com:443/MCU0805MD1002DP500-Vishay-datasheet-182027964.pdf?src-supplier=IHS; ComponentLink2URL: https://datasheet.octopart.com:443/MCU0805MD1002DP500-Vishay-datasheet-81842982.pdf?src-supplier=Upverter; ComponentLink2Description: https://datasheet.octopart.com:443/MCU0805MD1002DP500-Vishay-datasheet-81842982.pdf?src-supplier=Upverter; ComponentLink3URL: https://datasheet.octopart.com:443/MCU0805MD1002DP500-Vishay-datasheet-169971017.pdf?src-supplier=Future+Electronics; ComponentLink3Description: https://datasheet.octopart.com:443/MCU0805MD1002DP500-Vishay-datasheet-169971017.pdf?src-supplier=Future+Electronics; ComponentLink4URL: https://datasheet.octopart.com:443/MCU0805MD1002DP500-Vishay-datasheet-114607041.pdf?src-supplier=Future+Electronics; ComponentLink4Description: https://datasheet.octopart.com:443/MCU0805MD1002DP500-Vishay-datasheet-114607041.pdf?src-supplier=Future+Electronics; ComponentLink5URL: http://sigma.octopart.com:80/rohs_statement/Vishay-company-15.pdf?src-supplier=Compliance+Statements; ComponentLink5Description: http://sigma.octopart.com:80/rohs_statement/Vishay-company-15.pdf?src-supplier=Compliance+Statements
U3 = 61300411121: Led RGB; Manufacturer: Wurth Elektronik; Connector Type: Male Pin; Contact Resistance: 20mΩ; Current Rating: 3A; Gender: Male; Number of Contacts: 4; Operating Supply Voltage: 250V; Pitch: 2.54mm; Supplier: DigiKey; Supplier Part Number: 732-5317-ND; Manufacturer Part Number: 61300411121; RoHS: Compliant; Category: Headers and Wire Housings; Stock: 89389; Pricing: 1=0,17, 10=0,147, 25=0,1216, 50=0,1018, 100=0,0918, 1000=0,085 (USD); Color: Black; Contact Material: Gold; Contact Mating Length: 5.9944mm; Contact Plating: Gold; Height: 8.89mm; Lead Free: Lead Free; Lead Pitch: 2.54mm; Max Operating Temperature: 105°C; Min Operating Temperature: -40°C; Mounting Technology: Through Hole; Pins: 4; Number of Positions: 4; Number of Rows: 1; Orientation: Vertical; Packaging: Bulk; Termination: Solder; Voltage Rating: 250V; ComponentLink1URL: https://datasheet.octopart.com:443/61300411121-W%C3%BCrth-Elektronik-datasheet-44382959.pdf?src-supplier=Future+Electronics; ComponentLink1Description: https://datasheet.octopart.com:443/61300411121-W%C3%BCrth-Elektronik-datasheet-44382959.pdf?src-supplier=Future+Electronics; ComponentLink2URL: https://datasheet.octopart.com:443/61300411121-W%C3%BCrth-Elektronik-datasheet-149524049.pdf?src-supplier=Farnell; ComponentLink2Description: https://datasheet.octopart.com:443/61300411121-W%C3%BCrth-Elektronik-datasheet-149524049.pdf?src-supplier=Farnell; ComponentLink3URL: https://datasheet.octopart.com:443/61300411121-W%C3%BCrth-Elektronik-datasheet-21154836.pdf?src-supplier=element14+APAC; ComponentLink3Description: https://datasheet.octopart.com:443/61300411121-W%C3%BCrth-Elektronik-datasheet-21154836.pdf?src-supplier=element14+APAC; ComponentLink4URL: https://datasheet.octopart.com:443/61300411121-Wurth-Elektronik-datasheet-169474491.pdf?src-supplier=RS+(Formerly+Allied+Electronics); ComponentLink4Description: https://datasheet.octopart.com:443/61300411121-Wurth-Elektronik-datasheet-169474491.pdf?src-supplier=RS+(Formerly+Allied+Electronics)